# Altium schematic sheet PLD_RadFET_Mux.SchDoc: A 24-bit AD7714YRZ Analog-to-Digital Converter
size A4; Revision: 1; SheetTotal: 32; Model: DM1
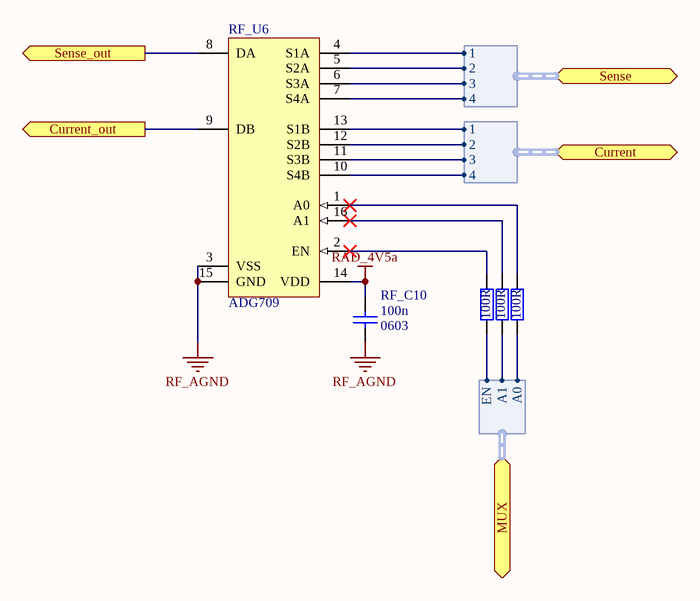
[diagram p0: PLD_RadFET_Mux.SchDoc]

## Parts
RF_C10  value 100n  Package: 0603  [SMD_Capacitor_0603]  (hidden comment: Cap)
RF_R6  100R  [SMD_Resistor_0603]
RF_R23  100R  [SMD_Resistor_0603]
RF_R24  100R  [SMD_Resistor_0603]
RF_U6  ADG709  [TSSOP16]

## Ports
Current (harness ADG709_MUX_CH), Current_out (out), MUX (harness ADG709_MUX), Sense (harness ADG709_MUX_CH), Sense_out (out)

## Harnesses
ADG709_MUX: A0, A1, EN
ADG709_MUX_CH: 1, 2, 3, 4
ADG709_MUX_CH: 2, 3, 4, 1

## Nets
RAD_4V5a: RF_C10.1 RF_U6.14(VDD)
RF_AGND: RF_C10.2 RF_U6.3(VSS) RF_U6.15(GND)
Current_out: RF_U6.9(DB) ; port Current_out
Sense_out: RF_U6.8(DA) ; port Sense_out
NetRF_R6_1: RF_R6.1 ; port MUX.A1
NetRF_R6_2: RF_R6.2 RF_U6.16(A1)
NetRF_R23_1: RF_R23.1 ; port MUX.EN
NetRF_R23_2: RF_R23.2 RF_U6.2(EN)
NetRF_R24_1: RF_R24.1 ; port MUX.A0
NetRF_R24_2: RF_R24.2 RF_U6.1(A0)
NetRF_U6_4: RF_U6.4(S1A) ; port Sense.1
NetRF_U6_5: RF_U6.5(S2A) ; port Sense.2
NetRF_U6_6: RF_U6.6(S3A) ; port Sense.3
NetRF_U6_7: RF_U6.7(S4A) ; port Sense.4
NetRF_U6_10: RF_U6.10(S4B) ; port Current.4
NetRF_U6_11: RF_U6.11(S3B) ; port Current.3
NetRF_U6_12: RF_U6.12(S2B) ; port Current.2
NetRF_U6_13: RF_U6.13(S1B) ; port Current.1

## Notes on the sheet
- Title:
- Project:
- Author:
- Model:
- Document Number:
- Checked by:
- Rev:
- Date:
- Approved by:
- Sheet:
- of
- File name:

## Library data of the parts
RF_R6 RF_R23 RF_R24 = Res: Value: 100R; Package: 0603
RF_U6 = ADG709: CMOS Analog 4-Channel Multiplexer; Manufacturer: Analog Devices; ManufacturerPartNumber: ADG709